# Altium schematic sheet [19] Switching Regulator Module.SchDoc: Switching regulator module
size 299 x 210 mm; Address1: Gruvgatan 8; Address2: SE-42130 Västra Frölunda; Address3: http://www.omnisys.se; Address4: Phone: +46 31 734 3400; Revision: Rev; SheetNumber: 19; SheetTotal: 21; CompanyName: Omnisys Instruments AB; Project: Enter value; ReleaseDate: Date; PageSetup: Record=PageOptions|CenterHorizontal=True|CenterVertical=True|PrintScale=0.97|XCorrection=1.00|YCorrection=1.00|PrintKind=0|BorderSize=5000000|LeftOffset=0|BottomOffset=0|Orientation=2|PaperLength=1000|PaperWidth=1000|Scale=100|PaperSource=7|PrintQuality=-4|MediaType=1|DitherType=10|PaperKind=A3|PrintScaleMode=1; Notes: No notes; Part_And_Rev: 0000-00; Drawing_Configuration: No Configuration; Adr1: August Barks gata 6B; Adr2: SE-421 32 Västra Frölunda; Adr3: Sweden; Webpage: www.omnisys.se
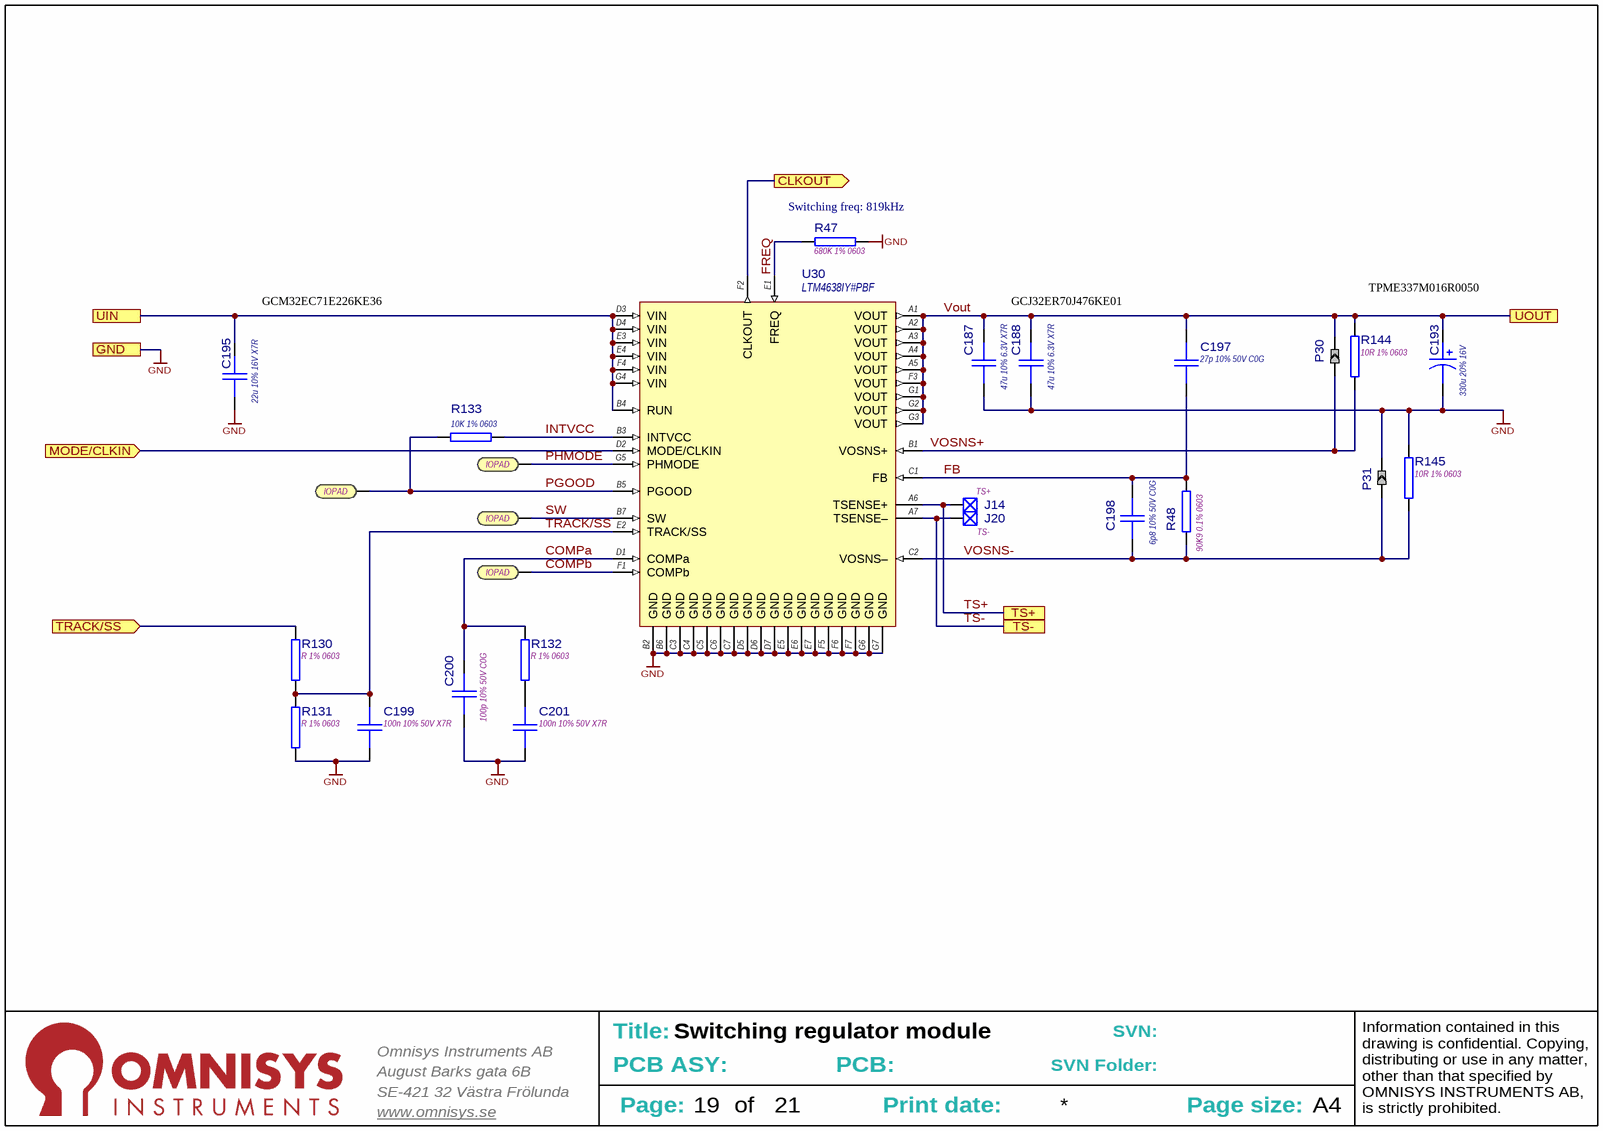
[diagram p0: [19] Switching Regulator Module.SchDoc]

## Parts
C187  47u 10% 6.3V X7R  [CAPC3225X270N]
C188  47u 10% 6.3V X7R  [CAPC3225X270N]
C193  330u 20% 16V  [CAPMP7343X43N]
C195  22u 10% 16V X7R  [CAPC3225X270N]
C197  27p 10% 50V C0G  [CAPC1608X90N]
C198  6p8 10% 50V C0G  [CAPC1608X90N]
C199  100n 10% 50V X7R  [CAPC1608X90N]
C200  100p 10% 50V C0G  [CAPC1608X90N]
C201  100n 10% 50V X7R  [CAPC1608X90N]
J12  IOPAD  [SMT_IO_PAD_2x1MM]  (no BOM)
J13  IOPAD  [SMT_IO_PAD_2x1MM]  (no BOM)
J14  TS+  [TP-SMD_1MM]
J16  IOPAD  [SMT_IO_PAD_2x1MM]  (no BOM)
J20  TS-  [TP-SMD_1MM]
J21  IOPAD  [SMT_IO_PAD_2x1MM]  (no BOM)
P30  Solder Jumper  [SolderJumper-Footprint-1]  (value not drawn)  (no BOM)
P31  Solder Jumper  [SolderJumper-Footprint-1]  (value not drawn)  (no BOM)
R47  680K 1% 0603  [RESC1608N]
R48  90K9 0.1% 0603  [RESC1608L]
R130  R 1% 0603  [RESC1608N]
R131  R 1% 0603  [RESC1608N]
R132  R 1% 0603  [RESC1608N]
R133  10K 1% 0603  [RESC1608L]
R144  10R 1% 0603  [RESC1608N]
R145  10R 1% 0603  [RESC1608N]
U30  LTM4638IY#PBF  [BGA49C80P7X7_625X625X536]

## Ports
CLKOUT (out), GND, MODE/CLKIN (in), TRACK/SS (in), TS+, TS-, UIN, UOUT

## Nets
GND: C187.2 C188.2 C193.2 C195.2 C199.2 C200.2 C201.2 P31.2 R47.1 R131.1 R145.2 U30.B2(GND) U30.B6(GND) U30.C3(GND) U30.C4(GND) U30.C5(GND) U30.C6(GND) U30.C7(GND) U30.D5(GND) U30.D6(GND) U30.D7(GND) U30.E5(GND) U30.E6(GND) U30.E7(GND) U30.F5(GND) U30.F6(GND) U30.F7(GND) U30.G6(GND) U30.G7(GND) ; port GND
CLKOUT: U30.F2(CLKOUT) ; port CLKOUT
COMPa: C200.1 R132.2 U30.D1(COMPa)
COMPb: J21.1 U30.F1(COMPb)
FB: C197.2 C198.1 R48.2 U30.C1(FB)
FREQ: R47.2 U30.E1(FREQ)
INTVCC: R133.2 U30.B3(INTVCC)
MODE/CLKIN: U30.D2(MODE/CLKIN) ; port MODE/CLKIN
PGOOD: J12.1 R133.1 U30.B5(PGOOD)
PHMODE: J13.1 U30.G5(PHMODE)
SW: J16.1 U30.B7(SW)
TRACK/SS: C199.1 R130.1 R131.2 U30.E2(TRACK/SS)
TRACK/SS: R130.2 ; port TRACK/SS  [a separate net that carries the same name]
TS+: J14.1 U30.A6(TSENSE+) ; port TS+
TS-: J20.1 U30.A7(TSENSE–) ; port TS-
UIN: C195.1 U30.B4(RUN) U30.D3(VIN) U30.D4(VIN) U30.E3(VIN) U30.E4(VIN) U30.F4(VIN) U30.G4(VIN) ; port UIN
VOSNS+: P30.1 R144.1 U30.B1(VOSNS+)
VOSNS-: C198.2 P31.1 R48.1 R145.1 U30.C2(VOSNS–)
Vout: C187.1 C188.1 C193.1 C197.1 P30.2 R144.2 U30.A1(VOUT) U30.A2(VOUT) U30.A3(VOUT) U30.A4(VOUT) U30.A5(VOUT) U30.F3(VOUT) U30.G1(VOUT) U30.G2(VOUT) U30.G3(VOUT) ; port UOUT
NetC201_1: C201.1 R132.1

## Notes on the sheet
- (near R47) Switching freq: 819kHz
- GCM32EC71E226KE36
- GCJ32ER70J476KE01
- TPME337M016R0050
- August Barks gata 6B
- Omnisys Instruments AB
- Title:
- PCB ASY:
- PCB:
- SVN:
- SVN Folder:
- SE-421 32 Västra Frölunda
- www.omnisys.se
- Page:
- of
- Print date:
- Page size:
- A4
- Information contained in this drawing is confidential. Copying, distributing or use in any matter, other than that specified by OMNISYS INSTRUMENTS AB, is strictly prohibited.

## Library data of the parts
C187 C188 = CMP-0300-002062-5: Ceramic Chip Capacitor, 1210/3225; Capacitance: 47µF; Temperature Charateristics: X7R; Tolerance: 10%; Thickness: 2.7mm; Case/Package: 1210/3225; Rated Voltage: 6.3V
C193 = CMP-0300-000208-8: Standard tantalum capacitor, 7343/Case E; DCL: 52.8A; Capacitance: 330µF; DF: 30%; ESR: 0.4; Rated Voltage: 16V; Tolerance: 20%; Case/Package: 7343
C195 = CMP-0300-003327-5: Ceramic Chip Capacitor, 1210/3225; Capacitance: 22µF; Tolerance: 10%; Temperature Charateristics: X7R; Thickness: 2.7mm; Case/Package: 1210/3225; Rated Voltage: 16V
C197 = CMP-0300-002442-6: Ceramic Chip Capacitor, 0603/1608; Tolerance: 5%; Capacitance: 27pF; Package: 1608/0603; Temperature Charateristics: C0G; Rated Voltage: 50V; Thickness: 900µm; Weight: 9mg
C198 = CMP-0300-002430-5: Ceramic Chip Capacitor, 0603/1608; Tolerance: 0%; Capacitance: 6.8pF; Package: 1608/0603; Temperature Charateristics: C0G; Rated Voltage: 50V; Thickness: 900µm; Weight: 9mg
C199 C201 = CMP-0300-002665-6: Ceramic Chip Capacitor, 0603/1608; Capacitance: 100nF; Package: 1608/0603; Temperature Charateristics: X7R; Tolerance: 10%; Rated Voltage: 50V; Thickness: 900µm; Weight: 9mg
C200 = CMP-0300-002450-6: Ceramic Chip Capacitor, 0603/1608; Tolerance: 5%; Capacitance: 100pF; Package: 1608/0603; Temperature Charateristics: C0G; Rated Voltage: 50V; Thickness: 900µm; Weight: 9mg
J12 J13 J16 J21 = CMP-1000-000152-5: IO pad used for test points and flying leads.
J14 J20 = CMP-3600-000000-1: TP SMD 1mm
P30 P31 = CMP-1600-000025-5: Solder jumper, clearance 0.125mm
R47 = CMP-1800-002089-5: Thick film Chip Resistor, 0603/1608; Power: 100mW; Maximum working voltage: 75V; Temp. Coefficent: 0.01%; Tolerance: 1%; Value: 680k; Case/Package: 0603/1608; Composition: Thick film
R48 = CMP-1800-002529-4: Thin film Chip Resistor, 0603/1608; Value: 90.9k; Maximum working voltage: 50V; Power: 100mW; Temp. Coefficent: 0.0015%; Tolerance: 0.1%; Case/Package: 0603/1608; Composition: Thin film
R130-R132 = CMP-1800-003157-4: Thick film Chip Resistor, 0603/1608; Power: 100mW; Maximum working voltage: 75V; Temp. Coefficent: 0.01%; Value: 1G; Tolerance: 1%; Case/Package: 0603/1608; Composition: Thick film
R133 = CMP-1800-002045-5: Thick film Chip Resistor, 0603/1608; Power: 100mW; Maximum working voltage: 75V; Temp. Coefficent: 0.01%; Value: 10k; Tolerance: 1%; Case/Package: 0603/1608; Composition: Thick film
R144 R145 = CMP-1800-001974-5: Thick film Chip Resistor, 0603/1608; Value: 10; Power: 100mW; Maximum working voltage: 75V; Temp. Coefficent: 0.01%; Tolerance: 1%; Case/Package: 0603/1608; Composition: Thick film
U30 = CMP-2100-000582-3: 20Vin, 15A Step-Down DC/DC uModule Regulator